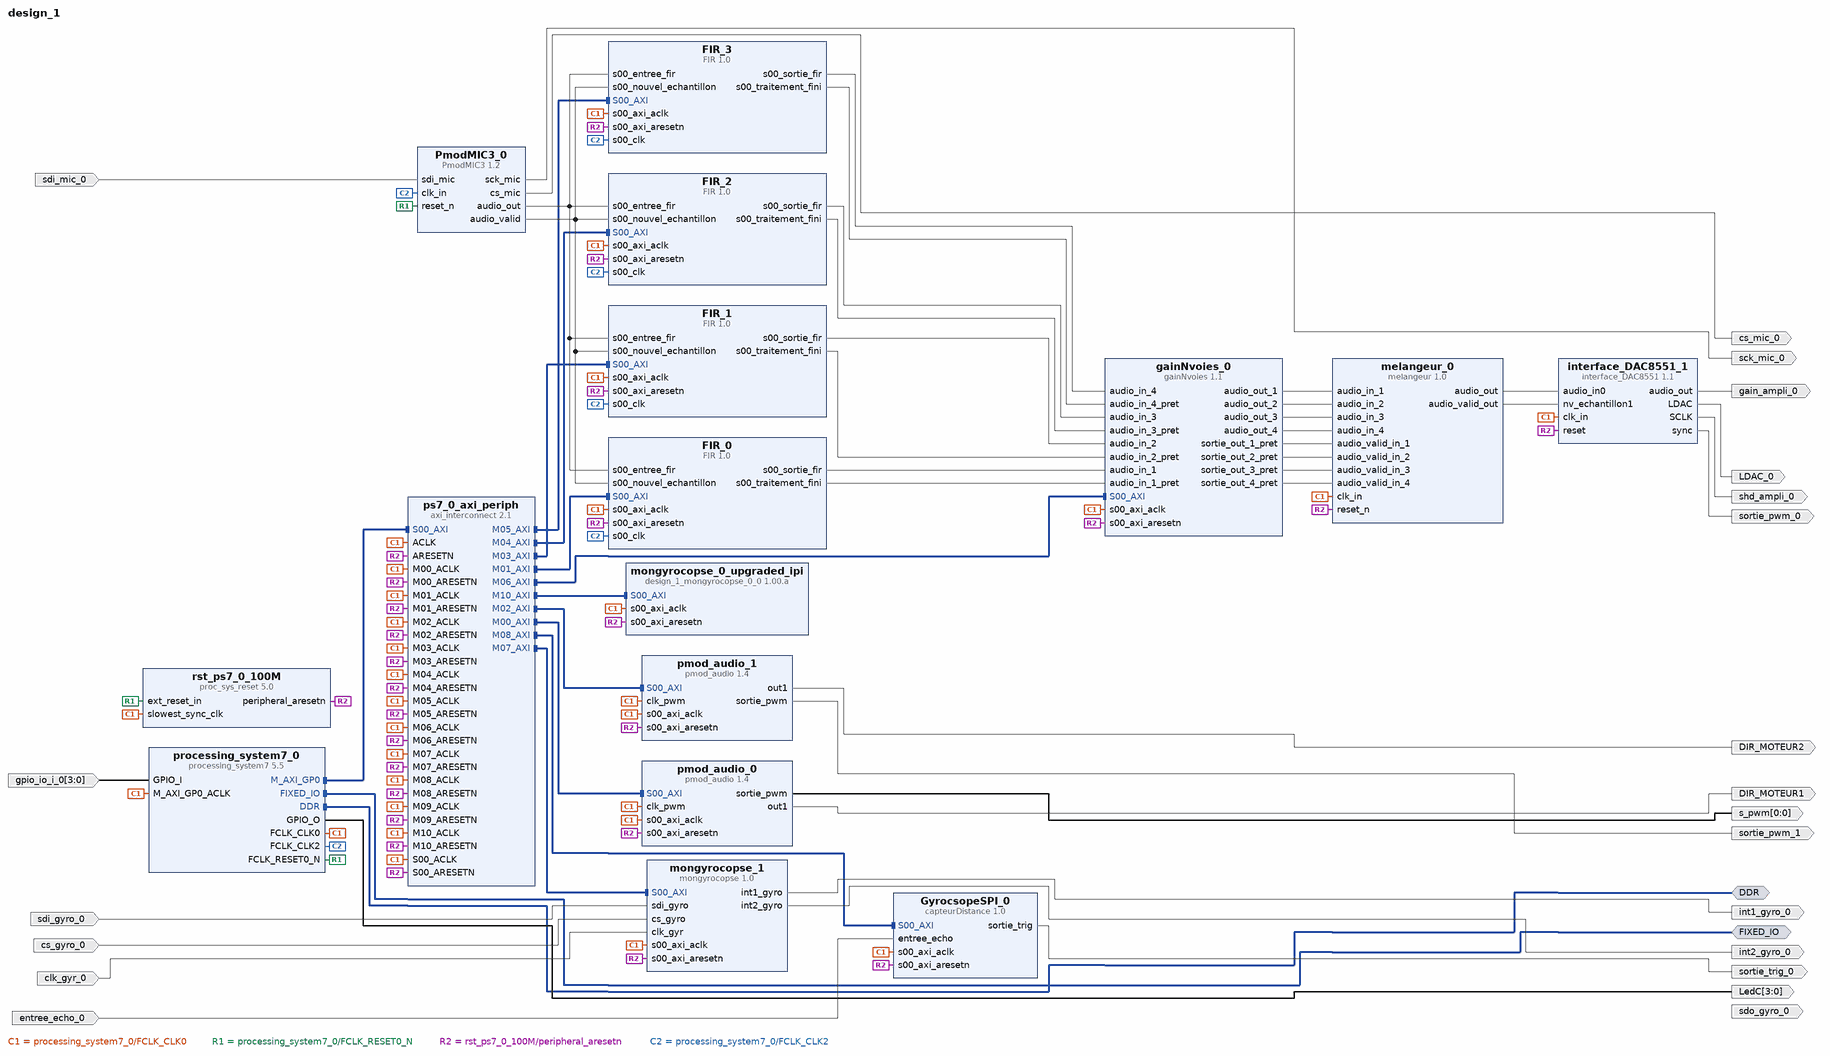
[diagram p0: block diagram of the top level]
# Vivado block design design_1, xc7z010clg400-1, Vivado 2019.2.1
create_bd_design design_1

create_bd_intf_port -mode Master -vlnv xilinx.com:interface:ddrx_rtl:1.0 DDR
create_bd_intf_port -mode Master -vlnv xilinx.com:display_processing_system7:fixedio_rtl:1.0 FIXED_IO
create_bd_port -dir O -from 3 -to 0 LedC
create_bd_port -dir O gain_ampli_0
create_bd_port -dir O sortie_pwm_0
create_bd_port -dir O shd_ampli_0
create_bd_port -dir O sck_mic_0
create_bd_port -dir O cs_mic_0
create_bd_port -dir I sdi_mic_0
create_bd_port -dir O LDAC_0
create_bd_port -dir I -from 3 -to 0 gpio_io_i_0
create_bd_port -dir O -from 0 -to 0 s_pwm
create_bd_port -dir O sortie_pwm_1
create_bd_port -dir O DIR_MOTEUR1
create_bd_port -dir O DIR_MOTEUR2
create_bd_port -dir I entree_echo_0
create_bd_port -dir O sortie_trig_0
create_bd_port -dir I sdi_gyro_0
create_bd_port -dir I cs_gyro_0
create_bd_port -dir I clk_gyr_0
create_bd_port -dir O sdo_gyro_0
create_bd_port -dir O int1_gyro_0
create_bd_port -dir O int2_gyro_0

create_bd_cell -type ip -vlnv xilinx.com:ip:processing_system7:5.5 processing_system7_0
set_property -dict [list \
  CONFIG.PCW_APU_PERIPHERAL_FREQMHZ 650 \
  CONFIG.PCW_CRYSTAL_PERIPHERAL_FREQMHZ 50.000000 \
  CONFIG.PCW_ENET0_ENET0_IO EMIO \
  CONFIG.PCW_ENET0_GRP_MDIO_ENABLE 1 \
  CONFIG.PCW_ENET0_GRP_MDIO_IO {MIO 52 .. 53} \
  CONFIG.PCW_ENET0_PERIPHERAL_ENABLE 1 \
  CONFIG.PCW_ENET0_PERIPHERAL_FREQMHZ {100 Mbps} \
  CONFIG.PCW_ENET0_RESET_ENABLE 0 \
  CONFIG.PCW_ENET_RESET_ENABLE 1 \
  CONFIG.PCW_ENET_RESET_SELECT {Share reset pin} \
  CONFIG.PCW_EN_CLK1_PORT 1 \
  CONFIG.PCW_EN_CLK2_PORT 1 \
  CONFIG.PCW_EN_CLK3_PORT 1 \
  CONFIG.PCW_FCLK_CLK1_BUF TRUE \
  CONFIG.PCW_FCLK_CLK2_BUF TRUE \
  CONFIG.PCW_FCLK_CLK3_BUF TRUE \
  CONFIG.PCW_FPGA0_PERIPHERAL_FREQMHZ 0.1 \
  CONFIG.PCW_FPGA1_PERIPHERAL_FREQMHZ 20 \
  CONFIG.PCW_FPGA2_PERIPHERAL_FREQMHZ 20 \
  CONFIG.PCW_FPGA3_PERIPHERAL_FREQMHZ 100 \
  CONFIG.PCW_FPGA_FCLK1_ENABLE 1 \
  CONFIG.PCW_FPGA_FCLK2_ENABLE 1 \
  CONFIG.PCW_FPGA_FCLK3_ENABLE 1 \
  CONFIG.PCW_GPIO_EMIO_GPIO_ENABLE 1 \
  CONFIG.PCW_GPIO_EMIO_GPIO_IO 4 \
  CONFIG.PCW_GPIO_EMIO_GPIO_WIDTH 4 \
  CONFIG.PCW_GPIO_MIO_GPIO_ENABLE 1 \
  CONFIG.PCW_GPIO_MIO_GPIO_IO MIO \
  CONFIG.PCW_I2C_RESET_ENABLE 1 \
  CONFIG.PCW_IRQ_F2P_INTR 1 \
  CONFIG.PCW_M_AXI_GP0_FREQMHZ 100 \
  CONFIG.PCW_NUM_F2P_INTR_INPUTS 1 \
  CONFIG.PCW_PERIPHERAL_BOARD_PRESET part0 \
  CONFIG.PCW_PRESET_BANK1_VOLTAGE {LVCMOS 1.8V} \
  CONFIG.PCW_QSPI_GRP_FBCLK_ENABLE 1 \
  CONFIG.PCW_QSPI_GRP_FBCLK_IO {MIO 8} \
  CONFIG.PCW_QSPI_GRP_SINGLE_SS_ENABLE 1 \
  CONFIG.PCW_QSPI_GRP_SINGLE_SS_IO {MIO 1 .. 6} \
  CONFIG.PCW_QSPI_PERIPHERAL_ENABLE 1 \
  CONFIG.PCW_QSPI_QSPI_IO {MIO 1 .. 6} \
  CONFIG.PCW_SD0_GRP_CD_ENABLE 1 \
  CONFIG.PCW_SD0_GRP_CD_IO {MIO 47} \
  CONFIG.PCW_SD0_GRP_WP_ENABLE 1 \
  CONFIG.PCW_SD0_GRP_WP_IO EMIO \
  CONFIG.PCW_SD0_PERIPHERAL_ENABLE 1 \
  CONFIG.PCW_SD0_SD0_IO {MIO 40 .. 45} \
  CONFIG.PCW_SDIO_PERIPHERAL_FREQMHZ 50 \
  CONFIG.PCW_SINGLE_QSPI_DATA_MODE x4 \
  CONFIG.PCW_TTC0_PERIPHERAL_ENABLE 1 \
  CONFIG.PCW_TTC0_TTC0_IO EMIO \
  CONFIG.PCW_UART1_PERIPHERAL_ENABLE 1 \
  CONFIG.PCW_UART1_UART1_IO {MIO 48 .. 49} \
  CONFIG.PCW_UART_PERIPHERAL_FREQMHZ 100 \
  CONFIG.PCW_UIPARAM_DDR_FREQ_MHZ 525 \
  CONFIG.PCW_UIPARAM_DDR_PARTNO {MT41K128M16 JT-125} \
  CONFIG.PCW_USB0_PERIPHERAL_ENABLE 1 \
  CONFIG.PCW_USB0_RESET_ENABLE 1 \
  CONFIG.PCW_USB0_RESET_IO {MIO 46} \
  CONFIG.PCW_USB0_USB0_IO {MIO 28 .. 39} \
  CONFIG.PCW_USB_RESET_ENABLE 1 \
  CONFIG.PCW_USB_RESET_SELECT {Share reset pin} \
  CONFIG.PCW_USE_FABRIC_INTERRUPT 1 \
] [get_bd_cells processing_system7_0]
# 506 more settings of processing_system7_0 are not shown: defaults, MIO pin electricals, DDR timing, and values the tool derives
create_bd_cell -type ip -vlnv xilinx.com:ip:proc_sys_reset:5.0 rst_ps7_0_100M
create_bd_cell -type ip -vlnv user.org:user:interface_DAC8551:1.1 interface_DAC8551_1
create_bd_cell -type ip -vlnv user.org:user:FIR:1.0 FIR_0
set_property -dict {CONFIG.numero 0} [get_bd_cells FIR_0]
create_bd_cell -type ip -vlnv user.org:user:FIR:1.0 FIR_1
set_property -dict {CONFIG.numero 1} [get_bd_cells FIR_1]
create_bd_cell -type ip -vlnv user.org:user:FIR:1.0 FIR_2
set_property -dict {CONFIG.numero 0} [get_bd_cells FIR_2]
create_bd_cell -type ip -vlnv user.org:user:FIR:1.0 FIR_3
set_property -dict {CONFIG.numero 0} [get_bd_cells FIR_3]
create_bd_cell -type ip -vlnv user.org:user:melangeur:1.0 melangeur_0
create_bd_cell -type ip -vlnv user.org:user:gainNvoies:1.1 gainNvoies_0
create_bd_cell -type ip -vlnv xilinx.com:ip:axi_interconnect:2.1 ps7_0_axi_periph
set_property -dict {CONFIG.NUM_MI 11} [get_bd_cells ps7_0_axi_periph]
create_bd_cell -type ip -vlnv xilinx.com:user:pmod_audio:1.4 pmod_audio_0
create_bd_cell -type ip -vlnv xilinx.com:user:pmod_audio:1.4 pmod_audio_1
create_bd_cell -type ip -vlnv moi.org:user:PmodMIC3:1.2 PmodMIC3_0
create_bd_cell -type ip -vlnv user.org:user:capteurDistance:1.0 GyrocsopeSPI_0
create_bd_cell -type ip -vlnv xilinx.com:ip:design_1_mongyrocopse_0_0:1.00.a mongyrocopse_0_upgraded_ipi
create_bd_cell -type ip -vlnv user.org:user:mongyrocopse:1.0 mongyrocopse_1

# ---- connections ----

connect_bd_intf_net [get_bd_intf_pins ps7_0_axi_periph/M10_AXI] [get_bd_intf_pins mongyrocopse_0_upgraded_ipi/S00_AXI]
connect_bd_intf_net [get_bd_intf_pins ps7_0_axi_periph/M05_AXI] [get_bd_intf_pins FIR_3/S00_AXI]
connect_bd_intf_net [get_bd_intf_pins ps7_0_axi_periph/M08_AXI] [get_bd_intf_pins GyrocsopeSPI_0/S00_AXI]
connect_bd_intf_net [get_bd_intf_pins FIR_0/S00_AXI] [get_bd_intf_pins ps7_0_axi_periph/M01_AXI]
connect_bd_intf_net [get_bd_intf_ports FIXED_IO] [get_bd_intf_pins processing_system7_0/FIXED_IO]
connect_bd_intf_net [get_bd_intf_pins ps7_0_axi_periph/M02_AXI] [get_bd_intf_pins pmod_audio_1/S00_AXI]
connect_bd_intf_net [get_bd_intf_pins ps7_0_axi_periph/M04_AXI] [get_bd_intf_pins FIR_2/S00_AXI]
connect_bd_intf_net [get_bd_intf_pins ps7_0_axi_periph/M00_AXI] [get_bd_intf_pins pmod_audio_0/S00_AXI]
connect_bd_intf_net [get_bd_intf_pins ps7_0_axi_periph/M06_AXI] [get_bd_intf_pins gainNvoies_0/S00_AXI]
connect_bd_intf_net [get_bd_intf_ports DDR] [get_bd_intf_pins processing_system7_0/DDR]
connect_bd_intf_net [get_bd_intf_pins processing_system7_0/M_AXI_GP0] [get_bd_intf_pins ps7_0_axi_periph/S00_AXI]
connect_bd_intf_net [get_bd_intf_pins ps7_0_axi_periph/M03_AXI] [get_bd_intf_pins FIR_1/S00_AXI]
connect_bd_intf_net [get_bd_intf_pins ps7_0_axi_periph/M07_AXI] [get_bd_intf_pins mongyrocopse_1/S00_AXI]
connect_bd_net [get_bd_pins processing_system7_0/FCLK_CLK0] \
  [get_bd_pins processing_system7_0/M_AXI_GP0_ACLK] [get_bd_pins rst_ps7_0_100M/slowest_sync_clk] \
  [get_bd_pins FIR_0/s00_axi_aclk] [get_bd_pins FIR_1/s00_axi_aclk] [get_bd_pins FIR_2/s00_axi_aclk] \
  [get_bd_pins FIR_3/s00_axi_aclk] [get_bd_pins gainNvoies_0/s00_axi_aclk] [get_bd_pins ps7_0_axi_periph/ACLK] \
  [get_bd_pins ps7_0_axi_periph/S00_ACLK] [get_bd_pins ps7_0_axi_periph/M00_ACLK] [get_bd_pins ps7_0_axi_periph/M01_ACLK] \
  [get_bd_pins ps7_0_axi_periph/M02_ACLK] [get_bd_pins ps7_0_axi_periph/M03_ACLK] [get_bd_pins ps7_0_axi_periph/M04_ACLK] \
  [get_bd_pins ps7_0_axi_periph/M05_ACLK] [get_bd_pins ps7_0_axi_periph/M06_ACLK] [get_bd_pins pmod_audio_0/s00_axi_aclk] \
  [get_bd_pins pmod_audio_1/clk_pwm] [get_bd_pins pmod_audio_1/s00_axi_aclk] [get_bd_pins ps7_0_axi_periph/M07_ACLK] \
  [get_bd_pins pmod_audio_0/clk_pwm] [get_bd_pins interface_DAC8551_1/clk_in] [get_bd_pins melangeur_0/clk_in] \
  [get_bd_pins ps7_0_axi_periph/M08_ACLK] [get_bd_pins GyrocsopeSPI_0/s00_axi_aclk] [get_bd_pins ps7_0_axi_periph/M09_ACLK] \
  [get_bd_pins ps7_0_axi_periph/M10_ACLK] [get_bd_pins mongyrocopse_0_upgraded_ipi/s00_axi_aclk] \
  [get_bd_pins mongyrocopse_1/s00_axi_aclk]
connect_bd_net [get_bd_pins processing_system7_0/FCLK_RESET0_N] [get_bd_pins rst_ps7_0_100M/ext_reset_in] [get_bd_pins PmodMIC3_0/reset_n]
connect_bd_net [get_bd_pins rst_ps7_0_100M/peripheral_aresetn] \
  [get_bd_pins interface_DAC8551_1/reset] [get_bd_pins FIR_0/s00_axi_aresetn] [get_bd_pins FIR_1/s00_axi_aresetn] \
  [get_bd_pins FIR_2/s00_axi_aresetn] [get_bd_pins FIR_3/s00_axi_aresetn] [get_bd_pins melangeur_0/reset_n] \
  [get_bd_pins gainNvoies_0/s00_axi_aresetn] [get_bd_pins ps7_0_axi_periph/ARESETN] \
  [get_bd_pins ps7_0_axi_periph/S00_ARESETN] [get_bd_pins ps7_0_axi_periph/M00_ARESETN] \
  [get_bd_pins ps7_0_axi_periph/M01_ARESETN] [get_bd_pins ps7_0_axi_periph/M02_ARESETN] \
  [get_bd_pins ps7_0_axi_periph/M03_ARESETN] [get_bd_pins ps7_0_axi_periph/M04_ARESETN] \
  [get_bd_pins ps7_0_axi_periph/M05_ARESETN] [get_bd_pins ps7_0_axi_periph/M06_ARESETN] \
  [get_bd_pins pmod_audio_0/s00_axi_aresetn] [get_bd_pins pmod_audio_1/s00_axi_aresetn] \
  [get_bd_pins ps7_0_axi_periph/M07_ARESETN] [get_bd_pins ps7_0_axi_periph/M08_ARESETN] \
  [get_bd_pins GyrocsopeSPI_0/s00_axi_aresetn] [get_bd_pins ps7_0_axi_periph/M09_ARESETN] \
  [get_bd_pins ps7_0_axi_periph/M10_ARESETN] [get_bd_pins mongyrocopse_0_upgraded_ipi/s00_axi_aresetn] \
  [get_bd_pins mongyrocopse_1/s00_axi_aresetn]
connect_bd_net [get_bd_pins PmodMIC3_0/sck_mic] [get_bd_ports sck_mic_0]
connect_bd_net [get_bd_pins PmodMIC3_0/cs_mic] [get_bd_ports cs_mic_0]
connect_bd_net -net sdi_mic_0_1 [get_bd_ports sdi_mic_0] [get_bd_pins PmodMIC3_0/sdi_mic]
connect_bd_net [get_bd_pins interface_DAC8551_1/LDAC] [get_bd_ports LDAC_0]
connect_bd_net [get_bd_pins interface_DAC8551_1/SCLK] [get_bd_ports shd_ampli_0]
connect_bd_net [get_bd_pins interface_DAC8551_1/sync] [get_bd_ports sortie_pwm_0]
connect_bd_net [get_bd_pins interface_DAC8551_1/audio_out] [get_bd_ports gain_ampli_0]
connect_bd_net [get_bd_pins PmodMIC3_0/audio_out] \
  [get_bd_pins FIR_0/s00_entree_fir] [get_bd_pins FIR_1/s00_entree_fir] [get_bd_pins FIR_3/s00_entree_fir] \
  [get_bd_pins FIR_2/s00_entree_fir]
connect_bd_net [get_bd_pins PmodMIC3_0/audio_valid] \
  [get_bd_pins FIR_0/s00_nouvel_echantillon] [get_bd_pins FIR_1/s00_nouvel_echantillon] \
  [get_bd_pins FIR_2/s00_nouvel_echantillon] [get_bd_pins FIR_3/s00_nouvel_echantillon]
connect_bd_net [get_bd_pins processing_system7_0/FCLK_CLK2] \
  [get_bd_pins FIR_0/s00_clk] [get_bd_pins FIR_1/s00_clk] [get_bd_pins FIR_2/s00_clk] [get_bd_pins FIR_3/s00_clk] \
  [get_bd_pins PmodMIC3_0/clk_in]
connect_bd_net [get_bd_pins melangeur_0/audio_out] [get_bd_pins interface_DAC8551_1/audio_in0]
connect_bd_net [get_bd_pins melangeur_0/audio_valid_out] [get_bd_pins interface_DAC8551_1/nv_echantillon1]
connect_bd_net [get_bd_pins FIR_0/s00_sortie_fir] [get_bd_pins gainNvoies_0/audio_in_1]
connect_bd_net [get_bd_pins FIR_1/s00_sortie_fir] [get_bd_pins gainNvoies_0/audio_in_2]
connect_bd_net [get_bd_pins FIR_2/s00_sortie_fir] [get_bd_pins gainNvoies_0/audio_in_3]
connect_bd_net [get_bd_pins FIR_3/s00_sortie_fir] [get_bd_pins gainNvoies_0/audio_in_4]
connect_bd_net [get_bd_pins FIR_3/s00_traitement_fini] [get_bd_pins gainNvoies_0/audio_in_4_pret]
connect_bd_net [get_bd_pins FIR_2/s00_traitement_fini] [get_bd_pins gainNvoies_0/audio_in_3_pret]
connect_bd_net [get_bd_pins FIR_1/s00_traitement_fini] [get_bd_pins gainNvoies_0/audio_in_2_pret]
connect_bd_net [get_bd_pins FIR_0/s00_traitement_fini] [get_bd_pins gainNvoies_0/audio_in_1_pret]
connect_bd_net [get_bd_pins gainNvoies_0/audio_out_1] [get_bd_pins melangeur_0/audio_in_1]
connect_bd_net [get_bd_pins gainNvoies_0/audio_out_2] [get_bd_pins melangeur_0/audio_in_2]
connect_bd_net [get_bd_pins gainNvoies_0/audio_out_3] [get_bd_pins melangeur_0/audio_in_3]
connect_bd_net [get_bd_pins gainNvoies_0/audio_out_4] [get_bd_pins melangeur_0/audio_in_4]
connect_bd_net [get_bd_pins gainNvoies_0/sortie_out_1_pret] [get_bd_pins melangeur_0/audio_valid_in_1]
connect_bd_net [get_bd_pins gainNvoies_0/sortie_out_2_pret] [get_bd_pins melangeur_0/audio_valid_in_2]
connect_bd_net [get_bd_pins gainNvoies_0/sortie_out_3_pret] [get_bd_pins melangeur_0/audio_valid_in_3]
connect_bd_net [get_bd_pins gainNvoies_0/sortie_out_4_pret] [get_bd_pins melangeur_0/audio_valid_in_4]
connect_bd_net -net gpio_io_i_0_1 [get_bd_ports gpio_io_i_0] [get_bd_pins processing_system7_0/GPIO_I]
connect_bd_net [get_bd_pins processing_system7_0/GPIO_O] [get_bd_ports LedC]
connect_bd_net [get_bd_pins pmod_audio_0/sortie_pwm] [get_bd_ports s_pwm]
connect_bd_net [get_bd_pins pmod_audio_1/sortie_pwm] [get_bd_ports sortie_pwm_1]
connect_bd_net [get_bd_pins pmod_audio_0/out1] [get_bd_ports DIR_MOTEUR1]
connect_bd_net [get_bd_pins pmod_audio_1/out1] [get_bd_ports DIR_MOTEUR2]
connect_bd_net -net entree_echo_0_1 [get_bd_ports entree_echo_0] [get_bd_pins GyrocsopeSPI_0/entree_echo]
connect_bd_net [get_bd_pins GyrocsopeSPI_0/sortie_trig] [get_bd_ports sortie_trig_0]
connect_bd_net -net sdi_gyro_0_1 [get_bd_ports sdi_gyro_0] [get_bd_pins mongyrocopse_1/sdi_gyro]
connect_bd_net -net cs_gyro_0_1 [get_bd_ports cs_gyro_0] [get_bd_pins mongyrocopse_1/cs_gyro]
connect_bd_net -net clk_gyr_0_1 [get_bd_ports clk_gyr_0] [get_bd_pins mongyrocopse_1/clk_gyr]
connect_bd_net [get_bd_pins mongyrocopse_1/int1_gyro] [get_bd_ports int1_gyro_0]
connect_bd_net [get_bd_pins mongyrocopse_1/int2_gyro] [get_bd_ports int2_gyro_0]

# ---- address map ----
assign_bd_address -offset 0x43C00000 -range 64K -target_address_space [get_bd_addr_spaces processing_system7_0/Data] [get_bd_addr_segs pmod_audio_0/S00_AXI/S00_AXI_reg]
assign_bd_address -offset 0x43C10000 -range 64K -target_address_space [get_bd_addr_spaces processing_system7_0/Data] [get_bd_addr_segs FIR_0/S00_AXI/S00_AXI_reg]
assign_bd_address -offset 0x43C20000 -range 4K -target_address_space [get_bd_addr_spaces processing_system7_0/Data] [get_bd_addr_segs FIR_1/S00_AXI/S00_AXI_reg]
assign_bd_address -offset 0x43C30000 -range 64K -target_address_space [get_bd_addr_spaces processing_system7_0/Data] [get_bd_addr_segs FIR_2/S00_AXI/S00_AXI_reg]
assign_bd_address -offset 0x43C40000 -range 64K -target_address_space [get_bd_addr_spaces processing_system7_0/Data] [get_bd_addr_segs FIR_3/S00_AXI/S00_AXI_reg]
assign_bd_address -offset 0x43C50000 -range 64K -target_address_space [get_bd_addr_spaces processing_system7_0/Data] [get_bd_addr_segs gainNvoies_0/S00_AXI/S00_AXI_reg]
assign_bd_address -offset 0x43C60000 -range 64K -target_address_space [get_bd_addr_spaces processing_system7_0/Data] [get_bd_addr_segs pmod_audio_1/S00_AXI/S00_AXI_reg]
assign_bd_address -offset 0x43C70000 -range 64K -target_address_space [get_bd_addr_spaces processing_system7_0/Data] [get_bd_addr_segs mongyrocopse_1/S00_AXI/S00_AXI_reg]
assign_bd_address -offset 0x43C80000 -range 64K -target_address_space [get_bd_addr_spaces processing_system7_0/Data] [get_bd_addr_segs GyrocsopeSPI_0/S00_AXI/S00_AXI_reg]

validate_bd_design
save_bd_design
